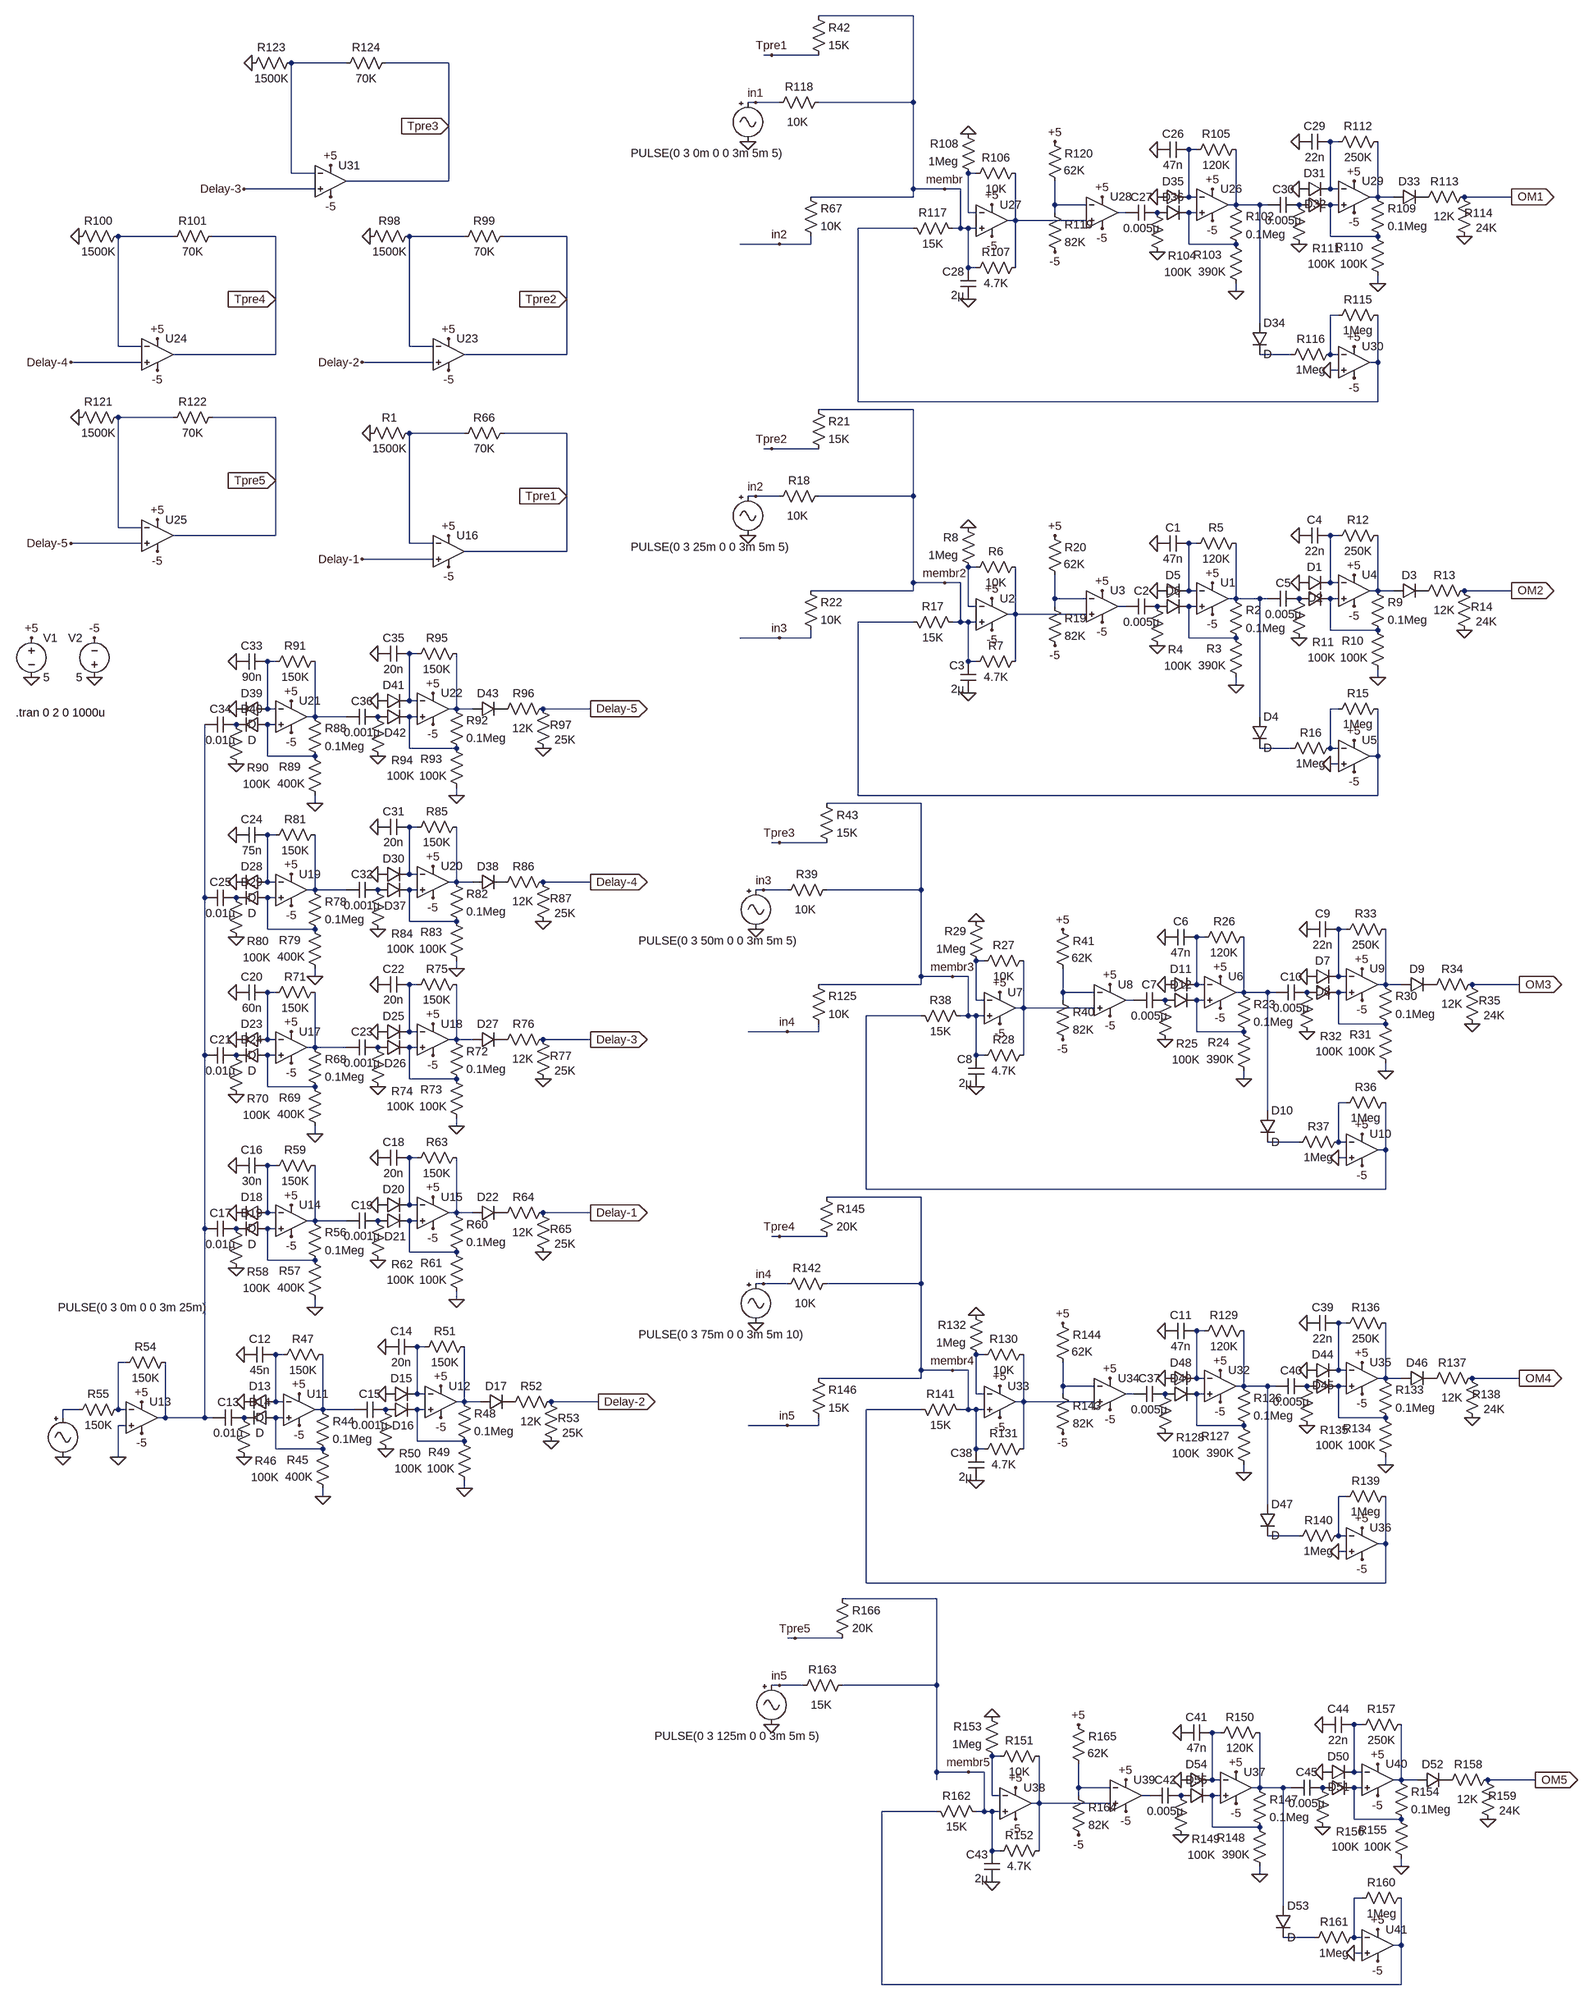
[diagram p0: schematic somaforprototype.asc]
* somaforprototype.asc
V1 +5 0 5
V2 0 -5 5
XU26 N010 N003 +5 -5 N007 level.2 Avol=1Meg GBW=10Meg Slew=10Meg ilimit=25m rail=0 Vos=0 phimargin=45 en=0 enk=0 in=0 ink=0 Rin=500Meg  ; pins IN+ IN- V+ V- OUT
R102 N007 N010 0.1Meg
R103 0 N010 390K
R104 P001 0 100K
R105 N007 N003 120K
C26 N003 0 47n
C27 P001 N009 0.005µ
XU27 membr N004 +5 -5 N011 level.2 Avol=1Meg GBW=10Meg Slew=10Meg ilimit=25m rail=0 Vos=0 phimargin=45 en=0 enk=0 in=0 ink=0 Rin=500Meg  ; pins IN+ IN- V+ V- OUT
C28 0 membr 2µ
R106 N011 N004 10K
R107 N011 membr 4.7K
R108 N004 0 1Meg
XU28 N011 N006 +5 -5 N009 level.2 Avol=1Meg GBW=10Meg Slew=10Meg ilimit=25m rail=0 Vos=0 phimargin=45 en=0 enk=0 in=0 ink=0 Rin=500Meg  ; pins IN+ IN- V+ V- OUT
XU29 N008 N002 +5 -5 N005 level.2 Avol=1Meg GBW=10Meg Slew=10Meg ilimit=25m rail=0 Vos=0 phimargin=45 en=0 enk=0 in=0 ink=0 Rin=500Meg  ; pins IN+ IN- V+ V- OUT
D31 0 N002 D
D32 P002 N008 D
R109 N005 N008 0.1Meg
R110 0 N008 100K
R111 P002 0 100K
R112 N005 N002 250K
C29 N002 0 22n
C30 P002 N007 0.005µ
D33 N005 P003 D
R113 OM1 P003 12K
R114 0 OM1 24K
XU30 0 N015 +5 -5 N012 level.2 Avol=1Meg GBW=10Meg Slew=10Meg ilimit=25m rail=0 Vos=0 phimargin=45 en=0 enk=0 in=0 ink=0 Rin=500Meg  ; pins IN+ IN- V+ V- OUT
R115 N012 N015 1Meg
R116 N016 N015 1Meg
D34 N007 N016 D
R117 N012 membr 15K
R118 membr in1 10K
V24 in1 0 PULSE(0 3 0m 0 0 3m 5m 5)
R119 N006 -5 82K
R120 +5 N006 62K
D35 0 N003 D
D36 P001 N010 D
R42 membr Tpre1 15K
XU11 N088 N073 +5 -5 N085 level.2 Avol=1Meg GBW=10Meg Slew=10Meg ilimit=25m rail=0 Vos=0 phimargin=45 en=0 enk=0 in=0 ink=0 Rin=500Meg  ; pins IN+ IN- V+ V- OUT
D13 N073 0 D
D14 N088 P004 D
R44 N085 N088 0.1Meg
R45 0 N088 400K
R46 P004 0 100K
R47 N085 N073 150K
C12 N073 0 45n
C13 P004 N043 0.01µ
V6 N084 0 PULSE(0 3 0m 0 0 3m 25m)
XU12 N086 N072 +5 -5 N082 level.2 Avol=1Meg GBW=10Meg Slew=10Meg ilimit=25m rail=0 Vos=0 phimargin=45 en=0 enk=0 in=0 ink=0 Rin=500Meg  ; pins IN+ IN- V+ V- OUT
D15 0 N072 D
D16 P005 N086 D
R48 N082 N086 0.1Meg
R49 0 N086 100K
R50 P005 0 100K
R51 N082 N072 150K
C14 N072 0 20n
C15 P005 N085 0.001µ
D17 N082 P006 D
R52 Delay-2 P006 12K
R53 0 Delay-2 25K
XU13 0 N075 +5 -5 N043 level.2 Avol=1Meg GBW=10Meg Slew=10Meg ilimit=25m rail=0 Vos=0 phimargin=45 en=0 enk=0 in=0 ink=0 Rin=500Meg  ; pins IN+ IN- V+ V- OUT
R54 N043 N075 150K
R55 N075 N084 150K
XU14 N069 N065 +5 -5 N067 level.2 Avol=1Meg GBW=10Meg Slew=10Meg ilimit=25m rail=0 Vos=0 phimargin=45 en=0 enk=0 in=0 ink=0 Rin=500Meg  ; pins IN+ IN- V+ V- OUT
D18 N065 0 D
D19 N069 P007 D
R56 N067 N069 0.1Meg
R57 0 N069 400K
R58 P007 0 100K
R59 N067 N065 150K
C16 N065 0 30n
C17 P007 N043 0.01µ
XU15 N068 N064 +5 -5 N066 level.2 Avol=1Meg GBW=10Meg Slew=10Meg ilimit=25m rail=0 Vos=0 phimargin=45 en=0 enk=0 in=0 ink=0 Rin=500Meg  ; pins IN+ IN- V+ V- OUT
D20 0 N064 D
D21 P008 N068 D
R60 N066 N068 0.1Meg
R61 0 N068 100K
R62 P008 0 100K
R63 N066 N064 150K
C18 N064 0 20n
C19 P008 N067 0.001µ
D22 N066 P009 D
R64 Delay-1 P009 12K
R65 0 Delay-1 25K
XU16 Delay-1 N018 +5 -5 Tpre1 level.2 Avol=1Meg GBW=10Meg Slew=10Meg ilimit=25m rail=0 Vos=0 phimargin=45 en=0 enk=0 in=0 ink=0 Rin=500Meg  ; pins IN+ IN- V+ V- OUT
R1 N018 0 1500K
R66 Tpre1 N018 70K
R67 membr in2 10K
XU17 N061 N050 +5 -5 N059 level.2 Avol=1Meg GBW=10Meg Slew=10Meg ilimit=25m rail=0 Vos=0 phimargin=45 en=0 enk=0 in=0 ink=0 Rin=500Meg  ; pins IN+ IN- V+ V- OUT
D23 N050 0 D
D24 N061 P010 D
R68 N059 N061 0.1Meg
R69 0 N061 400K
R70 P010 0 100K
R71 N059 N050 150K
C20 N050 0 60n
C21 P010 N043 0.01µ
XU18 N060 N048 +5 -5 N058 level.2 Avol=1Meg GBW=10Meg Slew=10Meg ilimit=25m rail=0 Vos=0 phimargin=45 en=0 enk=0 in=0 ink=0 Rin=500Meg  ; pins IN+ IN- V+ V- OUT
D25 0 N048 D
D26 P011 N060 D
R72 N058 N060 0.1Meg
R73 0 N060 100K
R74 P011 0 100K
R75 N058 N048 150K
C22 N048 0 20n
C23 P011 N059 0.001µ
D27 N058 P012 D
R76 Delay-3 P012 12K
R77 0 Delay-3 25K
XU19 N044 N039 +5 -5 N041 level.2 Avol=1Meg GBW=10Meg Slew=10Meg ilimit=25m rail=0 Vos=0 phimargin=45 en=0 enk=0 in=0 ink=0 Rin=500Meg  ; pins IN+ IN- V+ V- OUT
D28 N039 0 D
D29 N044 P013 D
R78 N041 N044 0.1Meg
R79 0 N044 400K
R80 P013 0 100K
R81 N041 N039 150K
C24 N039 0 75n
C25 P013 N043 0.01µ
XU20 N042 N038 +5 -5 N040 level.2 Avol=1Meg GBW=10Meg Slew=10Meg ilimit=25m rail=0 Vos=0 phimargin=45 en=0 enk=0 in=0 ink=0 Rin=500Meg  ; pins IN+ IN- V+ V- OUT
D30 0 N038 D
D37 P014 N042 D
R82 N040 N042 0.1Meg
R83 0 N042 100K
R84 P014 0 100K
R85 N040 N038 150K
C31 N038 0 20n
C32 P014 N041 0.001µ
D38 N040 P015 D
R86 Delay-4 P015 12K
R87 0 Delay-4 25K
XU21 N036 N031 +5 -5 N034 level.2 Avol=1Meg GBW=10Meg Slew=10Meg ilimit=25m rail=0 Vos=0 phimargin=45 en=0 enk=0 in=0 ink=0 Rin=500Meg  ; pins IN+ IN- V+ V- OUT
D39 N031 0 D
D40 N036 P016 D
R88 N034 N036 0.1Meg
R89 0 N036 400K
R90 P016 0 100K
R91 N034 N031 150K
C33 N031 0 90n
C34 P016 N043 0.01µ
XU22 N035 N030 +5 -5 N032 level.2 Avol=1Meg GBW=10Meg Slew=10Meg ilimit=25m rail=0 Vos=0 phimargin=45 en=0 enk=0 in=0 ink=0 Rin=500Meg  ; pins IN+ IN- V+ V- OUT
D41 0 N030 D
D42 P017 N035 D
R92 N032 N035 0.1Meg
R93 0 N035 100K
R94 P017 0 100K
R95 N032 N030 150K
C35 N030 0 20n
C36 P017 N034 0.001µ
D43 N032 P018 D
R96 Delay-5 P018 12K
R97 0 Delay-5 25K
XU23 Delay-2 N014 +5 -5 Tpre2 level.2 Avol=1Meg GBW=10Meg Slew=10Meg ilimit=25m rail=0 Vos=0 phimargin=45 en=0 enk=0 in=0 ink=0 Rin=500Meg  ; pins IN+ IN- V+ V- OUT
R98 N014 0 1500K
R99 Tpre2 N014 70K
XU24 Delay-4 N013 +5 -5 Tpre4 level.2 Avol=1Meg GBW=10Meg Slew=10Meg ilimit=25m rail=0 Vos=0 phimargin=45 en=0 enk=0 in=0 ink=0 Rin=500Meg  ; pins IN+ IN- V+ V- OUT
R100 N013 0 1500K
R101 Tpre4 N013 70K
XU25 Delay-5 N017 +5 -5 Tpre5 level.2 Avol=1Meg GBW=10Meg Slew=10Meg ilimit=25m rail=0 Vos=0 phimargin=45 en=0 enk=0 in=0 ink=0 Rin=500Meg  ; pins IN+ IN- V+ V- OUT
R121 N017 0 1500K
R122 Tpre5 N017 70K
XU31 Delay-3 N001 +5 -5 Tpre3 level.2 Avol=1Meg GBW=10Meg Slew=10Meg ilimit=25m rail=0 Vos=0 phimargin=45 en=0 enk=0 in=0 ink=0 Rin=500Meg  ; pins IN+ IN- V+ V- OUT
R123 N001 0 1500K
R124 Tpre3 N001 70K
XU1 N027 N020 +5 -5 N024 level.2 Avol=1Meg GBW=10Meg Slew=10Meg ilimit=25m rail=0 Vos=0 phimargin=45 en=0 enk=0 in=0 ink=0 Rin=500Meg  ; pins IN+ IN- V+ V- OUT
R2 N024 N027 0.1Meg
R3 0 N027 390K
R4 P019 0 100K
R5 N024 N020 120K
C1 N020 0 47n
C2 P019 N026 0.005µ
XU2 membr2 N021 +5 -5 N028 level.2 Avol=1Meg GBW=10Meg Slew=10Meg ilimit=25m rail=0 Vos=0 phimargin=45 en=0 enk=0 in=0 ink=0 Rin=500Meg  ; pins IN+ IN- V+ V- OUT
C3 0 membr2 2µ
R6 N028 N021 10K
R7 N028 membr2 4.7K
R8 N021 0 1Meg
XU3 N028 N023 +5 -5 N026 level.2 Avol=1Meg GBW=10Meg Slew=10Meg ilimit=25m rail=0 Vos=0 phimargin=45 en=0 enk=0 in=0 ink=0 Rin=500Meg  ; pins IN+ IN- V+ V- OUT
XU4 N025 N019 +5 -5 N022 level.2 Avol=1Meg GBW=10Meg Slew=10Meg ilimit=25m rail=0 Vos=0 phimargin=45 en=0 enk=0 in=0 ink=0 Rin=500Meg  ; pins IN+ IN- V+ V- OUT
D1 0 N019 D
D2 P020 N025 D
R9 N022 N025 0.1Meg
R10 0 N025 100K
R11 P020 0 100K
R12 N022 N019 250K
C4 N019 0 22n
C5 P020 N024 0.005µ
D3 N022 P021 D
R13 OM2 P021 12K
R14 0 OM2 24K
XU5 0 N033 +5 -5 N029 level.2 Avol=1Meg GBW=10Meg Slew=10Meg ilimit=25m rail=0 Vos=0 phimargin=45 en=0 enk=0 in=0 ink=0 Rin=500Meg  ; pins IN+ IN- V+ V- OUT
R15 N029 N033 1Meg
R16 N037 N033 1Meg
D4 N024 N037 D
R17 N029 membr2 15K
R18 membr2 in2 10K
V3 in2 0 PULSE(0 3 25m 0 0 3m 5m 5)
R19 N023 -5 82K
R20 +5 N023 62K
D5 0 N020 D
D6 P019 N027 D
R21 membr2 Tpre2 15K
R22 membr2 in3 10K
XU6 N055 N046 +5 -5 N052 level.2 Avol=1Meg GBW=10Meg Slew=10Meg ilimit=25m rail=0 Vos=0 phimargin=45 en=0 enk=0 in=0 ink=0 Rin=500Meg  ; pins IN+ IN- V+ V- OUT
R23 N052 N055 0.1Meg
R24 0 N055 390K
R25 P022 0 100K
R26 N052 N046 120K
C6 N046 0 47n
C7 P022 N054 0.005µ
XU7 membr3 N047 +5 -5 N056 level.2 Avol=1Meg GBW=10Meg Slew=10Meg ilimit=25m rail=0 Vos=0 phimargin=45 en=0 enk=0 in=0 ink=0 Rin=500Meg  ; pins IN+ IN- V+ V- OUT
C8 0 membr3 2µ
R27 N056 N047 10K
R28 N056 membr3 4.7K
R29 N047 0 1Meg
XU8 N056 N051 +5 -5 N054 level.2 Avol=1Meg GBW=10Meg Slew=10Meg ilimit=25m rail=0 Vos=0 phimargin=45 en=0 enk=0 in=0 ink=0 Rin=500Meg  ; pins IN+ IN- V+ V- OUT
XU9 N053 N045 +5 -5 N049 level.2 Avol=1Meg GBW=10Meg Slew=10Meg ilimit=25m rail=0 Vos=0 phimargin=45 en=0 enk=0 in=0 ink=0 Rin=500Meg  ; pins IN+ IN- V+ V- OUT
D7 0 N045 D
D8 P023 N053 D
R30 N049 N053 0.1Meg
R31 0 N053 100K
R32 P023 0 100K
R33 N049 N045 250K
C9 N045 0 22n
C10 P023 N052 0.005µ
D9 N049 P024 D
R34 OM3 P024 12K
R35 0 OM3 24K
XU10 0 N062 +5 -5 N057 level.2 Avol=1Meg GBW=10Meg Slew=10Meg ilimit=25m rail=0 Vos=0 phimargin=45 en=0 enk=0 in=0 ink=0 Rin=500Meg  ; pins IN+ IN- V+ V- OUT
R36 N057 N062 1Meg
R37 N063 N062 1Meg
D10 N052 N063 D
R38 N057 membr3 15K
R39 membr3 in3 10K
V4 in3 0 PULSE(0 3 50m 0 0 3m 5m 5)
R40 N051 -5 82K
R41 +5 N051 62K
D11 0 N046 D
D12 P022 N055 D
R43 membr3 Tpre3 15K
R125 membr3 in4 10K
XU32 N081 N071 +5 -5 N078 level.2 Avol=1Meg GBW=10Meg Slew=10Meg ilimit=25m rail=0 Vos=0 phimargin=45 en=0 enk=0 in=0 ink=0 Rin=500Meg  ; pins IN+ IN- V+ V- OUT
R126 N078 N081 0.1Meg
R127 0 N081 390K
R128 P025 0 100K
R129 N078 N071 120K
C11 N071 0 47n
C37 P025 N080 0.005µ
XU33 membr4 N074 +5 -5 N083 level.2 Avol=1Meg GBW=10Meg Slew=10Meg ilimit=25m rail=0 Vos=0 phimargin=45 en=0 enk=0 in=0 ink=0 Rin=500Meg  ; pins IN+ IN- V+ V- OUT
C38 0 membr4 2µ
R130 N083 N074 10K
R131 N083 membr4 4.7K
R132 N074 0 1Meg
XU34 N083 N077 +5 -5 N080 level.2 Avol=1Meg GBW=10Meg Slew=10Meg ilimit=25m rail=0 Vos=0 phimargin=45 en=0 enk=0 in=0 ink=0 Rin=500Meg  ; pins IN+ IN- V+ V- OUT
XU35 N079 N070 +5 -5 N076 level.2 Avol=1Meg GBW=10Meg Slew=10Meg ilimit=25m rail=0 Vos=0 phimargin=45 en=0 enk=0 in=0 ink=0 Rin=500Meg  ; pins IN+ IN- V+ V- OUT
D44 0 N070 D
D45 P026 N079 D
R133 N076 N079 0.1Meg
R134 0 N079 100K
R135 P026 0 100K
R136 N076 N070 250K
C39 N070 0 22n
C40 P026 N078 0.005µ
D46 N076 P027 D
R137 OM4 P027 12K
R138 0 OM4 24K
XU36 0 N089 +5 -5 N087 level.2 Avol=1Meg GBW=10Meg Slew=10Meg ilimit=25m rail=0 Vos=0 phimargin=45 en=0 enk=0 in=0 ink=0 Rin=500Meg  ; pins IN+ IN- V+ V- OUT
R139 N087 N089 1Meg
R140 N090 N089 1Meg
D47 N078 N090 D
R141 N087 membr4 15K
R142 membr4 in4 10K
V5 in4 0 PULSE(0 3 75m 0 0 3m 5m 10)
R143 N077 -5 82K
R144 +5 N077 62K
D48 0 N071 D
D49 P025 N081 D
R145 membr4 Tpre4 20K
R146 membr4 in5 15K
XU37 N099 N092 +5 -5 N096 level.2 Avol=1Meg GBW=10Meg Slew=10Meg ilimit=25m rail=0 Vos=0 phimargin=45 en=0 enk=0 in=0 ink=0 Rin=500Meg  ; pins IN+ IN- V+ V- OUT
R147 N096 N099 0.1Meg
R148 0 N099 390K
R149 P028 0 100K
R150 N096 N092 120K
C41 N092 0 47n
C42 P028 N098 0.005µ
XU38 membr5 N093 +5 -5 N100 level.2 Avol=1Meg GBW=10Meg Slew=10Meg ilimit=25m rail=0 Vos=0 phimargin=45 en=0 enk=0 in=0 ink=0 Rin=500Meg  ; pins IN+ IN- V+ V- OUT
C43 0 membr5 2µ
R151 N100 N093 10K
R152 N100 membr5 4.7K
R153 N093 0 1Meg
XU39 N100 N095 +5 -5 N098 level.2 Avol=1Meg GBW=10Meg Slew=10Meg ilimit=25m rail=0 Vos=0 phimargin=45 en=0 enk=0 in=0 ink=0 Rin=500Meg  ; pins IN+ IN- V+ V- OUT
XU40 N097 N091 +5 -5 N094 level.2 Avol=1Meg GBW=10Meg Slew=10Meg ilimit=25m rail=0 Vos=0 phimargin=45 en=0 enk=0 in=0 ink=0 Rin=500Meg  ; pins IN+ IN- V+ V- OUT
D50 0 N091 D
D51 P029 N097 D
R154 N094 N097 0.1Meg
R155 0 N097 100K
R156 P029 0 100K
R157 N094 N091 250K
C44 N091 0 22n
C45 P029 N096 0.005µ
D52 N094 P030 D
R158 OM5 P030 12K
R159 0 OM5 24K
XU41 0 N102 +5 -5 N101 level.2 Avol=1Meg GBW=10Meg Slew=10Meg ilimit=25m rail=0 Vos=0 phimargin=45 en=0 enk=0 in=0 ink=0 Rin=500Meg  ; pins IN+ IN- V+ V- OUT
R160 N101 N102 1Meg
R161 N103 N102 1Meg
D53 N096 N103 D
R162 N101 membr5 15K
R163 membr5 in5 15K
V7 in5 0 PULSE(0 3 125m 0 0 3m 5m 5)
R164 N095 -5 82K
R165 +5 N095 62K
D54 0 N092 D
D55 P028 N099 D
R166 membr5 Tpre5 20K
.model D D
.lib standard.dio
.tran 0 2 0 1000u
.lib UniversalOpamps2.sub
.backanno
.end